# EasyEDA Pro project 通用采样.eprj, schematic CKSR15
Board Name: CKSR15; Create Date: 2025-08-14; Page Name: P1; Project Name: 通用采样; Schematic Name: CKSR15; Update Date: 2025-08-14; Company: 嘉立创EDA; Page Size: A4; Version: V1.0
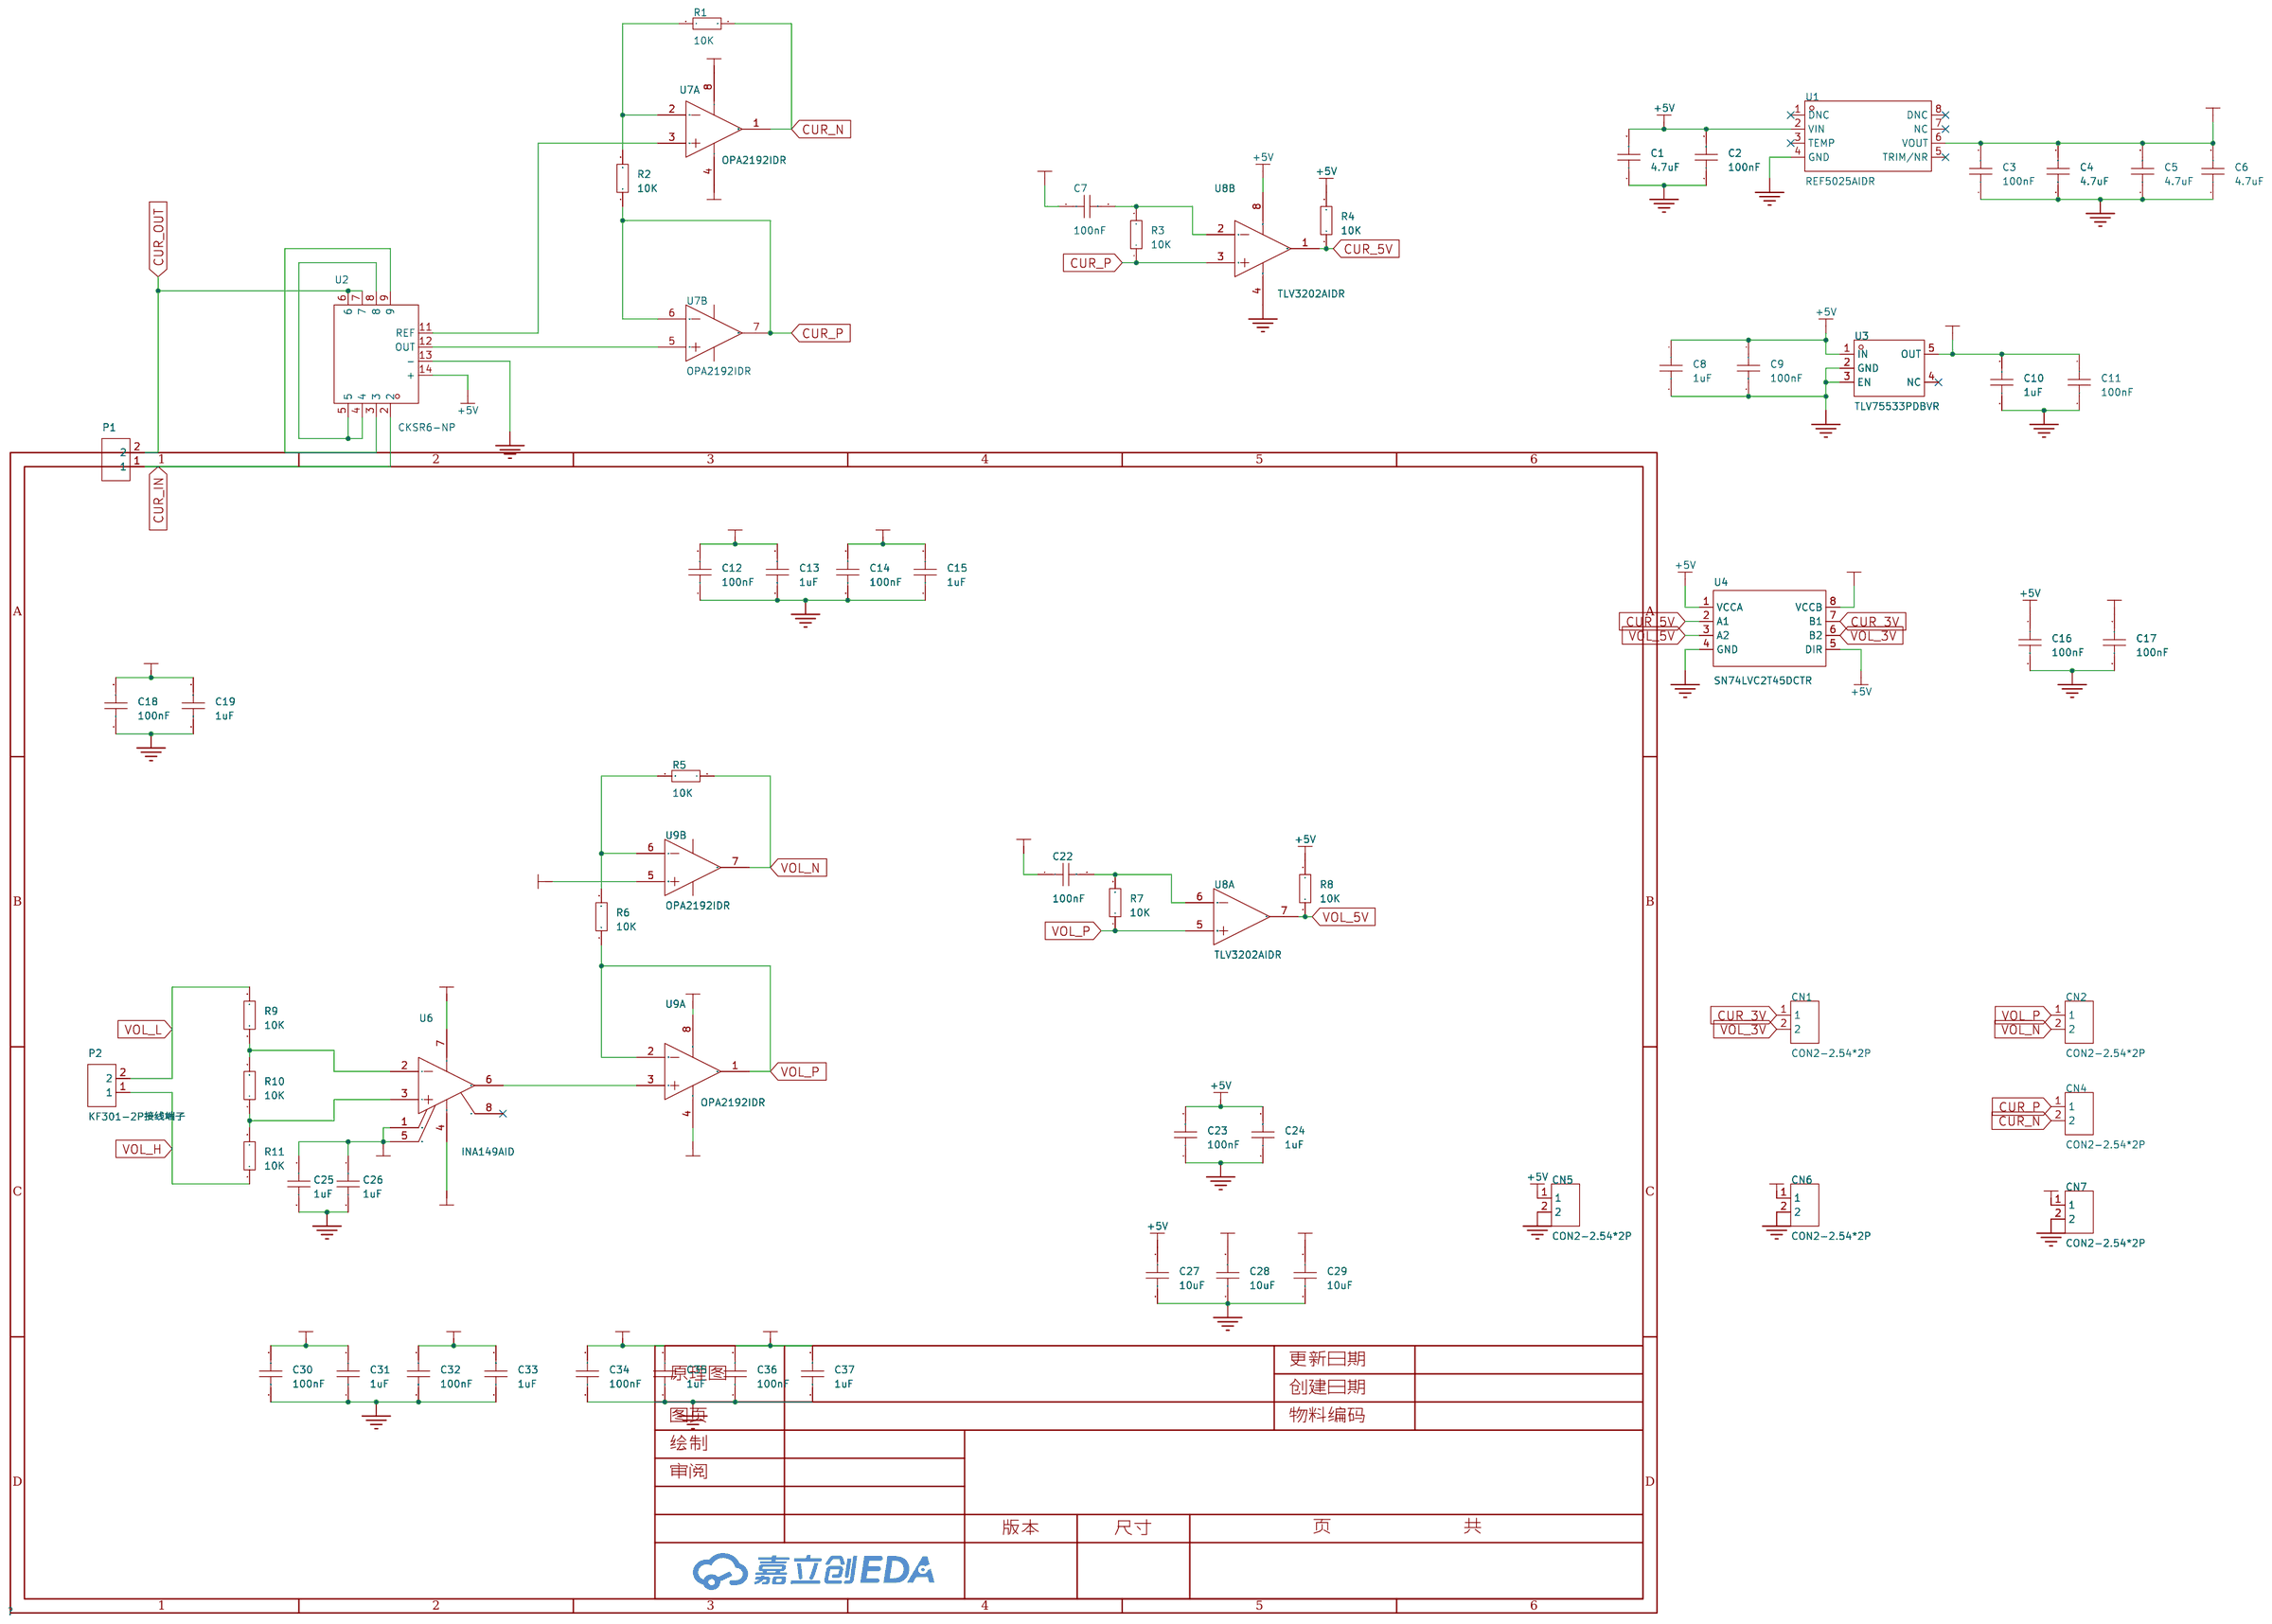
[diagram p1: schematic sheet]

## Parts
C1  4.7uF  [C0805]
C2  100nF  [C0805]
C3  100nF  [C0805]
C4  4.7uF  [C0805]
C5  4.7uF  [C0805]
C6  4.7uF  [C0805]
C7  100nF  [C0805]
C8  1uF  [C0805]
C9  100nF  [C0805]
C10  1uF  [C0805]
C11  100nF  [C0805]
C12  100nF  [C0805]
C13  1uF  [C0805]
C14  100nF  [C0805]
C15  1uF  [C0805]
C16  100nF  [C0805]
C17  100nF  [C0805]
C18  100nF  [C0805]
C19  1uF  [C0805]
C22  100nF  [C0805]
C23  100nF  [C0805]
C24  1uF  [C0805]
C25  1uF  [C0805]
C26  1uF  [C0805]
C27  10uF  [C0805]
C28  10uF  [C0805]
C29  10uF  [C0805]
C30  100nF  [C0805]
C31  1uF  [C0805]
C32  100nF  [C0805]
C33  1uF  [C0805]
C34  100nF  [C0805]
C35  1uF  [C0805]
C36  100nF  [C0805]
C37  1uF  [C0805]
CN1  CON2-2.54*2P  [CONN-TH_2P-P2.54-V]
CN2  CON2-2.54*2P  [CONN-TH_2P-P2.54-V]
CN4  CON2-2.54*2P  [CONN-TH_2P-P2.54-V]
CN5  CON2-2.54*2P  [CONN-TH_2P-P2.54-V]
CN6  CON2-2.54*2P  [CONN-TH_2P-P2.54-V]
CN7  CON2-2.54*2P  [CONN-TH_2P-P2.54-V]
P1  KF301-2P接线端子  [CONN-TH_XY301V-A-5.0-2P]
P2  KF301-2P接线端子  [CONN-TH_XY301V-A-5.0-2P]
R1  10K  [R0805]
R2  10K  [R0805]
R3  10K  [R0805]
R4  10K  [R0805]
R5  10K  [R0805]
R6  10K  [R0805]
R7  10K  [R0805]
R8  10K  [R0805]
R9  10K  [R0805]
R10  10K  [R0805]
R11  10K  [R0805]
U1  REF5025AIDR  [SOIC-8_L4.9-W3.9-P1.27-LS6.0-BL]
U2  CKSR6-NP  [SENSOR-TH_CKSR6-NP]
U3  TLV75533PDBVR  [SOT-23-5_L3.0-W1.7-P0.95-LS2.8-BR]
U4  SN74LVC2T45DCTR  [SM8_L3.2-W2.9-P0.65-LS4.3-BR]
U6  INA149AID  [SOIC-8_L4.9-W3.9-P1.27-LS6.0-BL]
U7  OPA2192IDR  [SOIC-8_L4.9-W3.9-P1.27-LS6.0-BL]  (sections 1,2)
U8  TLV3202AIDR  [SOIC-8_L4.9-W3.9-P1.27-LS6.0-BL]  (sections 1,2)
U9  OPA2192IDR  [SOIC-8_L4.9-W3.9-P1.27-LS6.0-BL]  (sections 1,2)

## Library data of the parts
C1-C19 C22-C37 = CAP_0805: Supplier Footprint: 0805
CN1 CN2 CN4-CN7 = CON2-2.54*2P: Supplier Part: C9900003238; Supplier Footprint: TH-2P; JLCPCB Part Class: Extended Part; Supplier: LCSC
P1 P2 = KF301-2P接线端子: Supplier Part: C9900016950; Supplier Footprint: CK301-2P; JLCPCB Part Class: Extended Part; Supplier: LCSC
R1-R11 = Res_0805: Supplier Footprint: 0805
U1 = REF5025AIDR: Supplier Part: C11341; Manufacturer: TI(德州仪器); Supplier Footprint: SOIC-8; JLCPCB Part Class: 扩展库; Datasheet: https://www.ti.com/cn/lit/gpn/ref5025; Supplier: LCSC; Output Type: 固定; Voltage - Supply: 2.7V~18V; Output Voltage: 2.5V; Output Current: 10mA; Tolerance: ±0.1%; Temperature Coefficient: 8ppm/℃; Reference Type: 串联; Quiescent Current: 1.2mA; Noise - 1/10Hz to 10Hz: 3uVp-p; Operating Temperature: -40℃~+125℃@(Ta)
U2 = CKSR6-NP: Supplier Part: C454684; Manufacturer: LEM(莱姆); Supplier Footprint: 插件; JLCPCB Part Class: 扩展库; Datasheet: https://item.szlcsc.com/datasheet/CKSR6-NP/456994.html; Supplier: LCSC
U3 = TLV75533PDBVR: 输出类型:固定;最大输入电压:5.5V;输出电压:3.3V;输出电流:500mA;电源纹波抑制比(PSRR):52dB;输出极性:正极;; LCSC Part Name: 具有使能功能的 500mA、高 PSRR、低 IQ、低压降稳压器; Supplier Part: C404027; Manufacturer: TI(德州仪器); Supplier Footprint: SOT-23-5; JLCPCB Part Class: 扩展库; Datasheet: https://www.ti.com/cn/lit/gpn/tlv755p; Supplier: LCSC; Output Type: 固定; Maximum Input Voltage: 5.5V; Output Voltage: 3.3V; Output Current: 500mA; Power Supply Rejection Ratio (PSRR): 52dB; Dropout Voltage: 238mV@(500mA); standby current: 31uA; Feature: 防静电保护；浪涌保护；低ESR；热保护(TSD)；欠压闭锁；过流保护(OCP)；带使能; Operating Temperature: -40℃~+125℃@(Tj); Output Polarity: 正极; Number of Outputs: 1
U4 = SN74LVC2T45DCTR: Supplier Part: C22672; Manufacturer: TI(德州仪器); Supplier Footprint: SM8; JLCPCB Part Class: 扩展库; Datasheet: https://www.ti.com/cn/lit/gpn/sn74lvc2t45; Supplier: LCSC; Channel Type: 双向; Data Rate: 420Mbps; Voltage - Supply(VCCA): 1.65V~5.5V; Voltage - Supply(VCCB): 1.65V~5.5V; Number of Circuits: 2; Output Type: 三态; Operating Temperature: -40℃~+85℃
U6 = INA149AID: 放大器数:单路;输入偏置电流(Ib):-;输入失调电压(Vos):350uV;增益带宽积(GBP):-;压摆率(SR):5V/us;带宽(-3db):500kHz;; Supplier Part: C1346122; Manufacturer: TI(德州仪器); Supplier Footprint: SOIC-8; JLCPCB Part Class: 扩展库; Datasheet: https://www.ti.com/cn/lit/gpn/ina149; Supplier: LCSC; Number of Circuits: 单路; Voltage - Input Offset(Vos): 350uV; Slew Rate(SR): 5V/us; -3db Bandwidth: 500kHz; Operating Temperature: -40℃~+125℃
U7 U9 = OPA2192IDR: 放大器数:双路;增益带宽积(GBP):10MHz;输入偏置电流(Ib):5pA;输入失调电压(Vos):-;压摆率(SR):20V/us;带宽(-3db):-;轨到轨:轨到轨输入输出;; Supplier Part: C110074; Manufacturer: TI(德州仪器); Supplier Footprint: SOIC-8; JLCPCB Part Class: 扩展库; Datasheet: https://www.ti.com/cn/lit/gpn/opa2192; Supplier: LCSC; Number of Circuits: 双路; Gain Bandwidth Product(GBP): 10MHz; Current - Input Bias(Ib): 5pA; Slew Rate(SR): 20V/us; Output Current: 65mA; Rail to Rail: 轨到轨输入输出; Supply Current: 1mA; Operating Temperature: -40℃~+125℃
U8 = TLV3202AIDR: LCSC Part Name: 40纳秒响应时间，低功耗，推挽输出比较器; Supplier Part: C129325; Manufacturer: TI(德州仪器); Supplier Footprint: SOIC-8; JLCPCB Part Class: 扩展库; Datasheet: https://www.ti.com/cn/lit/gpn/tlv3201; Supplier: LCSC; Number of Channels: 双路; Vos - Input Offset Voltage: 1mV; Ib - Input Bias Current: 50pA; Propagation Delay Time: 40ns; Input Hysteresis Voltage (Vhys): 1.2mV; Voltage - Supply: 2.7V~5.5V; Output Type: CMOS; Rail to Rail: 轨到轨输入; Quiescent Current per Amplifier: 40uA; Operating Temperature: -40℃~+125℃

## Nets
3.3V: C10.1 C11.1 C17.1 U3.5(OUT) U4.8(VCCB)
+2.5V: C3.2 C4.2 C5.2 C6.2 C7.1 C22.1 C25.1 C26.1 U1.6(VOUT) U6.1(REFB) U6.5(REFA) U9.5(VINB+)
+5V: C1.2 C2.2 C8.1 C9.1 C16.1 C18.2 C19.2 C23.2 C24.2 C27.2 CN5.1 R4.2 R8.2 U1.2(VIN) U2.14(+) U3.1(IN) U4.1(VCCA) U4.5(DIR) U8.8(VCC)
+12V: C12.2 C13.2 C28.2 C30.2 C31.2 C34.2 C35.2 CN6.1 U6.7(V+) U7.8(VDD) U9.8(VDD)
-12V: C14.2 C15.2 C29.2 C32.2 C33.2 C36.2 C37.2 CN7.1 U6.4(V-) U7.4(VSS) U9.4(VSS)
GND: C1.1 C2.1 C3.1 C4.1 C5.1 C6.1 C8.2 C9.2 C10.2 C11.2 C12.1 C13.1 C14.1 C15.1 C16.2 C17.2 C18.1 C19.1 C23.1 C24.1 C25.2 C26.2 C27.1 C28.1 C29.1 C30.1 C31.1 C32.1 C33.1 C34.1 C35.1 C36.1 C37.1 CN5.2 CN6.2 CN7.2 U1.4(GND) U2.13(-) U3.2(GND) U3.3(EN) U4.4(GND) U8.4(GND)
CUR_3V: CN1.1 U4.7(B1)
CUR_5V: R4.1 U4.2(A1) U8.1(OUT A)
CUR_IN: P1.1 U2.2
CUR_N: CN4.2 R1.1 U7.1(VOUTA)
CUR_OUT: P1.2 U2.6 U2.7
CUR_P: CN4.1 R2.1 R3.1 U7.6(VINB-) U7.7(VOUTB) U8.3(+IN A)
VOL_3V: CN1.2 U4.6(B2)
VOL_5V: R8.1 U4.3(A2) U8.7(OUT B)
VOL_H: P2.1 R11.1
VOL_L: P2.2 R9.2
VOL_N: CN2.2 R5.1 U9.7(VOUTB)
VOL_P: CN2.1 R6.1 R7.1 U8.5(+IN B) U9.1(VOUTA) U9.2(VINA-)
$1N3362: R9.1 R10.2 U6.2(-IN)
$1N3363: R10.1 R11.2 U6.3(+IN)
$1N3370: U6.6(VOUT) U9.3(VINA+)
$1N3373: R5.2 R6.2 U9.6(VINB-)
$1N3378: U2.12(OUT) U7.5(VINB+)
$1N3381: R1.2 R2.2 U7.2(VINA-)
$1N3382: U2.11(REF) U7.3(VINA+)
$1N3389: C22.2 R7.2 U8.6(-IN B)
$1N3392: C7.2 R3.2 U8.2(-IN A)
$1N3695: U2.3 U2.9
$1N3709: U2.4 U2.5 U2.8

Not connected (* = marked no-connect by the designer): U1 1(DNC)* 3(TEMP)* 5(TRIM/NR)* 7(NC)* 8(DNC)*; U3 4(NC)*; U6 8(NC)*
